# Altium schematic sheet external battery charger (w button) main board.SchDoc
size A
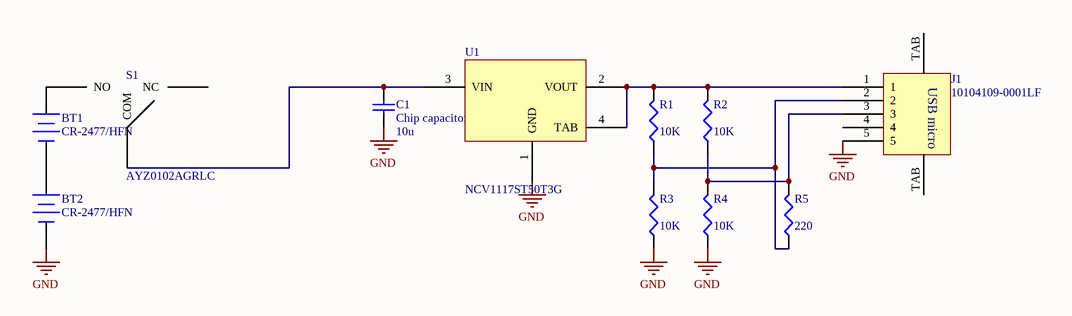
[diagram p0: external battery charger (w button) main board.SchDoc]

## Parts
BT1  CR-2477/HFN  [PCBComponent_1]
BT2  CR-2477/HFN  [PCBComponent_1]
C1  Chip capacitor 0603  value 10u  [RESC1608M]
J1  10104109-0001LF  [usb-microB-plug]
R1  value 10K  [RESC1608M]  (hidden comment: Chip resistor 0603)
R2  value 10K  [RESC1608M]  (hidden comment: Chip resistor 0603)
R3  value 10K  [RESC1608M]  (hidden comment: Chip resistor 0603)
R4  value 10K  [RESC1608M]  (hidden comment: Chip resistor 0603)
R5  value 220  [RESC1608M]  (hidden comment: Chip resistor 0603)
S1  AYZ0102AGRLC  [SPDT SWITCH SMD]
U1  NCV1117ST50T3G  [SOT223-4M]

## Nets
GND: BT2.2(-) C1.1 J1.5 R3.1 R4.1 U1.1(GND)
NetBT1_1: BT1.1(+) S1.1(NO)
NetBT1_2: BT1.2(-) BT2.1(+)
NetC1_2: C1.2 S1.2(COM) U1.3(VIN)
NetJ1_1: J1.1 R1.2 R2.2 U1.2(VOUT) U1.4(TAB)
NetJ1_2: J1.2 R1.1 R3.2 R5.1
NetJ1_3: J1.3 R2.1 R4.2 R5.2

Not connected (* = marked no-connect by the designer): J1 4 TAB(tab); S1 3(NC)

## Library data of the parts
BT1 BT2 = Battery: CR2477 battery with throughhole contacts; Published: 24-Mar-1999; LatestRevisionDate: 17-Jul-2002; LatestRevisionNote: Re-released for DXP Platform.; PackageReference: BAT-2; Publisher: Altium Limited; PackageDescription: Battery; 2 Leads
C1 = Cap Semi: Capacitor 10uF; Published: 8-Jun-2000; LatestRevisionDate: 29-May-2009; LatestRevisionNote: IPC-7351 Footprint Added.; PackageReference: C1206; Publisher: Altium Limited; PackageDescription: Chip Capacitor
J1 = USB micro: Micro USB plug, 5pin
R1-R4 = Res3: Resistor 10k; Published: 8-Jun-2000; LatestRevisionDate: 29-May-2009; LatestRevisionNote: IPC-7351 Footprint Added.; PackageReference: J1-0603; Publisher: Altium Limited; PackageDescription: Chip Resistor
R5 = Res3: Resistor 220 Ohm; Published: 8-Jun-2000; LatestRevisionDate: 29-May-2009; LatestRevisionNote: IPC-7351 Footprint Added.; PackageReference: J1-0603; Publisher: Altium Limited; PackageDescription: Chip Resistor
S1 = SPDT switch: Switch Slide SPDT SMD
U1 = Component_1: Voltage Regulator LDO 5V SOT223; pin to pad: 4>5